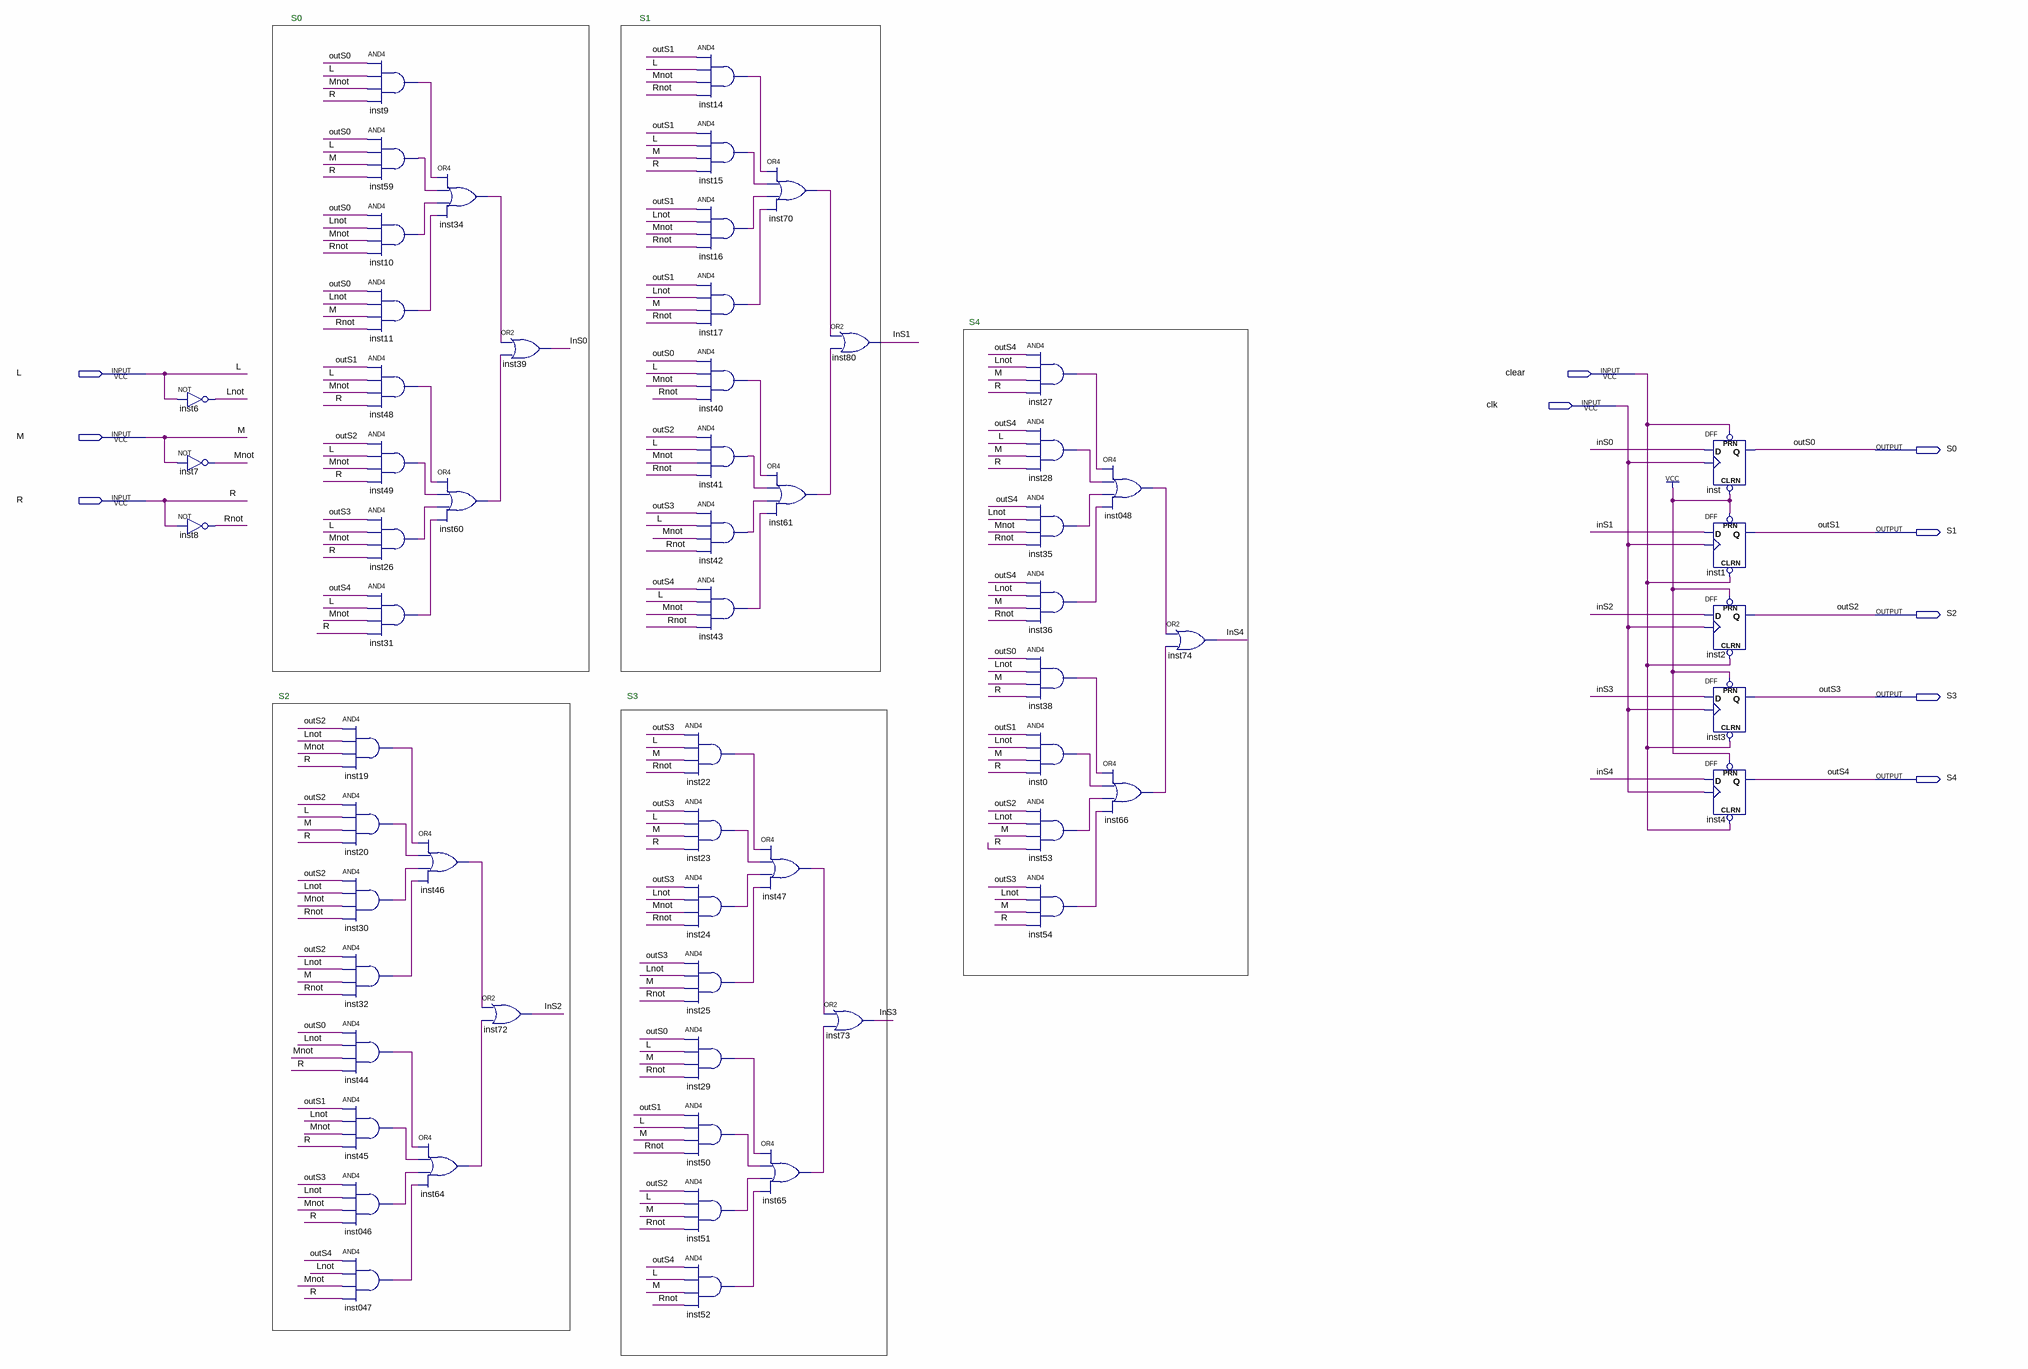
[diagram p0: schematic sheet]
// Quartus schematic Statemachines.bdf as structural Verilog: 63 symbols, 10 pins
module Statemachines (
  input  L,
  input  clear,
  input  clk,
  input  M,
  input  R,
  output S0,
  output S1,
  output S2,
  output S3,
  output S4
);

  wire inS0, inS1, inS2, inS3, inS4, inst0_out, inst9_out, inst10_out, inst11_out, inst14_out, inst15_out,
       inst16_out, inst17_out, inst19_out, inst20_out, inst22_out, inst23_out, inst24_out, inst25_out,
       inst26_out, inst27_out, inst28_out, inst29_out, inst30_out, inst31_out, inst32_out, inst34_out,
       inst35_out, inst36_out, inst38_out, inst40_out, inst41_out, inst42_out, inst43_out, inst44_out,
       inst45_out, inst046_out, inst46_out, inst047_out, inst47_out, inst48_out, inst048_out, inst49_out,
       inst50_out, inst51_out, inst52_out, inst53_out, inst54_out, inst59_out, inst60_out, inst61_out,
       inst64_out, inst65_out, inst66_out, inst70_out, Lnot, Mnot, Rnot;

  not inst6 (Lnot, L);
  not inst7 (Mnot, M);
  not inst8 (Rnot, R);
  and inst19 (inst19_out, S2, Lnot, Mnot, R);
  and inst20 (inst20_out, S2, L, M, R);
  and inst30 (inst30_out, S2, Lnot, Mnot, Rnot);
  and inst32 (inst32_out, S2, Lnot, M, Rnot);
  and inst44 (inst44_out, S0, Lnot, Mnot, R);
  and inst45 (inst45_out, S1, Lnot, Mnot, R);
  and inst046 (inst046_out, S3, Lnot, Mnot, R);
  and inst047 (inst047_out, S4, Lnot, Mnot, R);
  and inst9 (inst9_out, S0, L, Mnot, R);
  and inst59 (inst59_out, S0, L, M, R);
  and inst10 (inst10_out, S0, Lnot, Mnot, Rnot);
  and inst11 (inst11_out, S0, Lnot, M, Rnot);
  and inst48 (inst48_out, S1, L, Mnot, R);
  and inst49 (inst49_out, S2, L, Mnot, R);
  and inst26 (inst26_out, S3, L, Mnot, R);
  and inst31 (inst31_out, S4, L, Mnot, R);
  or inst34 (inst34_out, inst9_out, inst59_out, inst10_out, inst11_out);
  or inst60 (inst60_out, inst48_out, inst49_out, inst26_out, inst31_out);
  or inst46 (inst46_out, inst19_out, inst20_out, inst30_out, inst32_out);
  or inst64 (inst64_out, inst44_out, inst45_out, inst046_out, inst047_out);
  or inst39 (inS0, inst34_out, inst60_out);
  or inst72 (inS2, inst46_out, inst64_out);
  and inst14 (inst14_out, S1, L, Mnot, Rnot);
  and inst15 (inst15_out, S1, L, M, R);
  and inst16 (inst16_out, S1, Lnot, Mnot, Rnot);
  and inst17 (inst17_out, S1, Lnot, M, Rnot);
  and inst40 (inst40_out, S0, L, Mnot, Rnot);
  and inst41 (inst41_out, S2, L, Mnot, Rnot);
  and inst42 (inst42_out, S3, L, Mnot, Rnot);
  and inst43 (inst43_out, S4, L, Mnot, Rnot);
  and inst22 (inst22_out, S3, L, M, Rnot);
  and inst23 (inst23_out, S3, L, M, R);
  and inst24 (inst24_out, S3, Lnot, Mnot, Rnot);
  and inst25 (inst25_out, S3, Lnot, M, Rnot);
  and inst29 (inst29_out, S0, L, M, Rnot);
  and inst50 (inst50_out, S1, L, M, Rnot);
  and inst51 (inst51_out, S2, L, M, Rnot);
  and inst52 (inst52_out, S4, L, M, Rnot);
  or inst47 (inst47_out, inst22_out, inst23_out, inst24_out, inst25_out);
  or inst65 (inst65_out, inst29_out, inst50_out, inst51_out, inst52_out);
  or inst70 (inst70_out, inst14_out, inst15_out, inst16_out, inst17_out);
  or inst61 (inst61_out, inst40_out, inst41_out, inst42_out, inst43_out);
  or inst80 (inS1, inst70_out, inst61_out);
  or inst73 (inS3, inst47_out, inst65_out);
  and inst27 (inst27_out, S4, Lnot, M, R);
  and inst28 (inst28_out, S4, L, M, R);
  and inst35 (inst35_out, S4, Lnot, Mnot, Rnot);
  and inst36 (inst36_out, S4, Lnot, M, Rnot);
  and inst38 (inst38_out, S0, Lnot, M, R);
  and inst0 (inst0_out, S1, Lnot, M, R);
  and inst53 (inst53_out, S2, Lnot, M, R);
  and inst54 (inst54_out, S3, Lnot, M, R);
  or inst048 (inst048_out, inst27_out, inst28_out, inst35_out, inst36_out);
  or inst66 (inst66_out, inst38_out, inst0_out, inst53_out, inst54_out);
  or inst74 (inS4, inst048_out, inst66_out);
  DFF inst (.CLRN(1'b1), .CLK(clk), .D(inS0), .PRN(clear), .Q(S0));
  DFF inst1 (.CLRN(clear), .CLK(clk), .D(inS1), .PRN(1'b1), .Q(S1));
  DFF inst2 (.CLRN(clear), .CLK(clk), .D(inS2), .PRN(1'b1), .Q(S2));
  DFF inst3 (.CLRN(clear), .CLK(clk), .D(inS3), .PRN(1'b1), .Q(S3));
  DFF inst4 (.CLRN(clear), .CLK(clk), .D(inS4), .PRN(1'b1), .Q(S4));

  // Other names for the same wires on the sheet: outS0 = S0; outS1 = S1; outS2 = S2; outS3 = S3; outS4 = S4

  // Notes on the sheet:
  //   S0
  //   S1
  //   S4
  //   S2
  //   S3
endmodule
